# EAGLE design LMP9100_breakout_V2 (EAGLE 7.7.0)
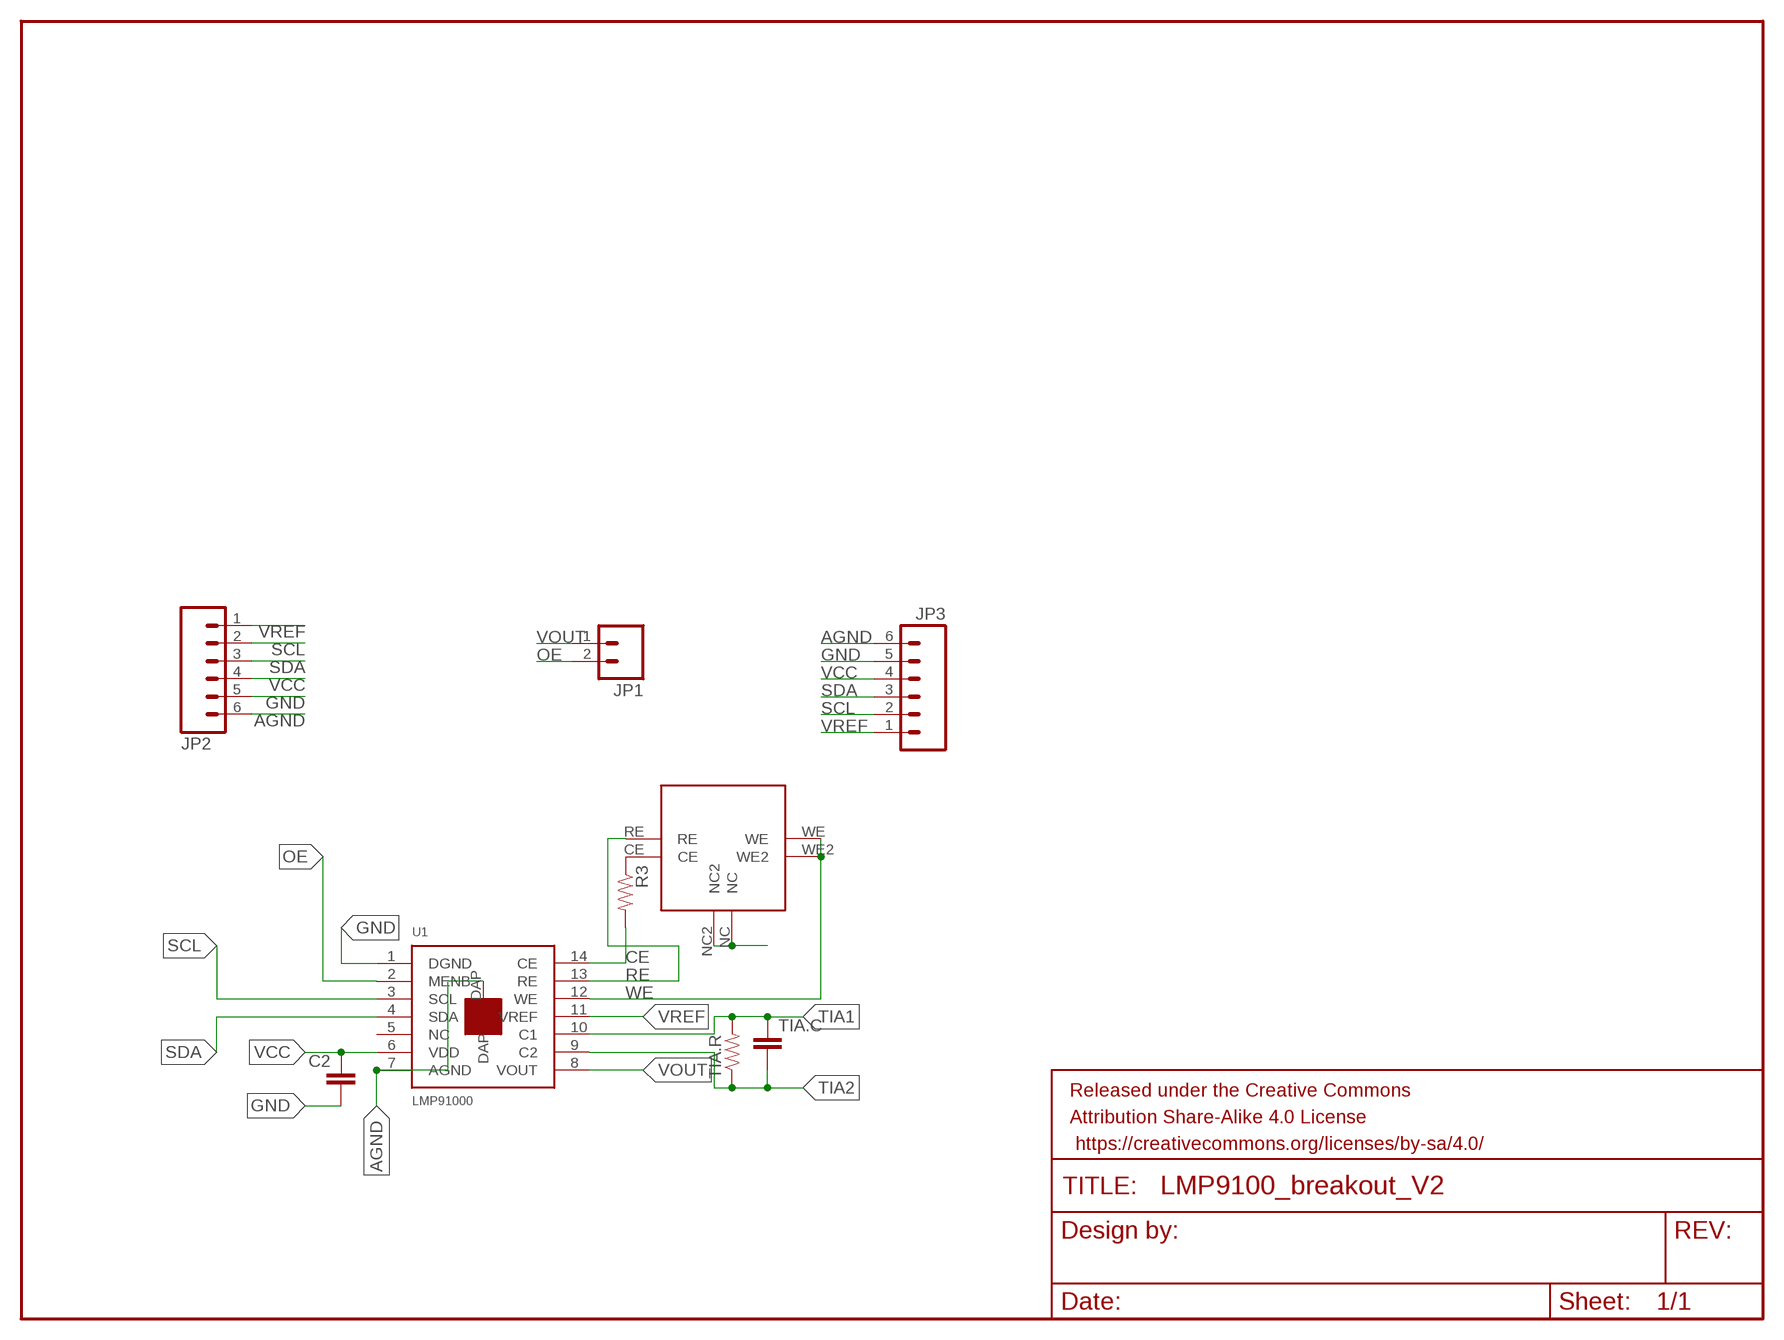
[diagram p0: schematic, sheet 1]

## Parts
C2  CAP0603-CAP  [0603-CAP]
FRAME1  FRAME-LETTER  [CREATIVE_COMMONS]
JP1  M02PTH  [1X02]
JP2  M06SILK_FEMALE_PTH  [1X06]
JP3  M06SILK_FEMALE_PTH  [1X06]
R3  RESISTOR0603-RES  [0603-RES]
TIA.C  CAP0603-CAP  [0603-CAP]
TIA.R  RESISTOR0603-RES  [0603-RES]
U1  LMP91000  [LMP91000]
U$1  SPEC-SENSOR  [SPEC-SENSOR]

## Nets
AGND: JP2.6 JP3.6 U1.7(AGND) U1.DAP
CE: R3.2 U1.14(CE)
GND: C2.2 JP2.5 JP3.5 U1.1(DGND) U$1.NC U$1.NC2
N$1: R3.1 U$1.CE
OE: JP1.2 U1.2(MENB)
RE: U1.13(RE) U$1.RE
SCL: JP2.2 JP3.2 U1.3(SCL)
SDA: JP2.3 JP3.3 U1.4(SDA)
TIA1: TIA.C.1 TIA.R.2 U1.10(C1)
TIA2: TIA.C.2 TIA.R.1 U1.9(C2)
VCC: C2.1 JP2.4 JP3.4 U1.6(VDD)
VOUT: JP1.1 U1.8(VOUT)
VREF: JP2.1 JP3.1 U1.11(VREF)
WE: U1.12(WE) U$1.WE U$1.WE2
Unconnected: U1.5(NC)

## Library data of the parts
C2 TIA.C = SparkFun-Passives:CAP: Capacitor Standard 0603 ceramic capacitor, and 0.1" leaded capacitor.
FRAME1 = SparkFun-Aesthetics:FRAME-LETTER: Schematic Frame Standard 8.5x11 US Letter frame
JP1 = SparkFun-Connectors:M02: Standard 2-pin 0.1" header. Use with - straight break away headers ( PRT-00116) - right angle break away headers (PRT-00553) - swiss pins (PRT-00743) - machine pins (PRT-00117) - female headers (PRT-00115) Molex polarized connector foot print use with: PRT-08233 with associated crimp pins and housings. 2.54_SCREWTERM for use with PRT-10571. 3.5mm Screw Terminal footprints for PRT-08084 5mm Screw Terminal footprints for use with PRT-08432
JP2 JP3 = SparkFun-Connectors:M06: Header 6 Standard 6-pin 0.1" header. Use with straight break away headers (SKU : PRT-00116), right angle break away headers (PRT-00553), swiss pins (PRT-00743), machine pins (PRT-00117), and female headers (PRT-00115). Molex polarized connector foot print use with SKU : PRT-08094 with associated crimp pins and housings. NOTES ON THE VARIANTS LOCK and LOCK_LONGPADS... This footprint was designed to help hold the alignment of a through-hole component (i.e. 6-pin header) while soldering it into place. You may notice that each hole has been shifted either up or down by 0.005 of an inch from it's more standard position (which is a perfectly straight line). This slight alteration caused the pins (the squares in the middle) to touch the edges of the holes. Because they are alternating, it causes a "brace" to hold the component in place. 0.005 has proven to be the perfect amount of "off-center" position when using our standard breakaway headers. Although looks a little odd when you look at the bare footprint, once you have a header in there, the alteration is very hard to notice. Also,if you push a header all the way into place, it is covered up entirely on the bottom side. This idea of altering the position of holes to aid alignment will be further integrated into the Sparkfun Library for other footprints. It can help hold any component with 3 or more connection pins.; PROD_ID: CONN-08437
R3 TIA.R = SparkFun-Passives:RESISTOR: Resistor Basic schematic elements and footprints for 0603, 1206, and PTH resistors.
U1 = lmp91000:LMP91000
U$1 = lmp91000:SPEC-SENSOR

## Board
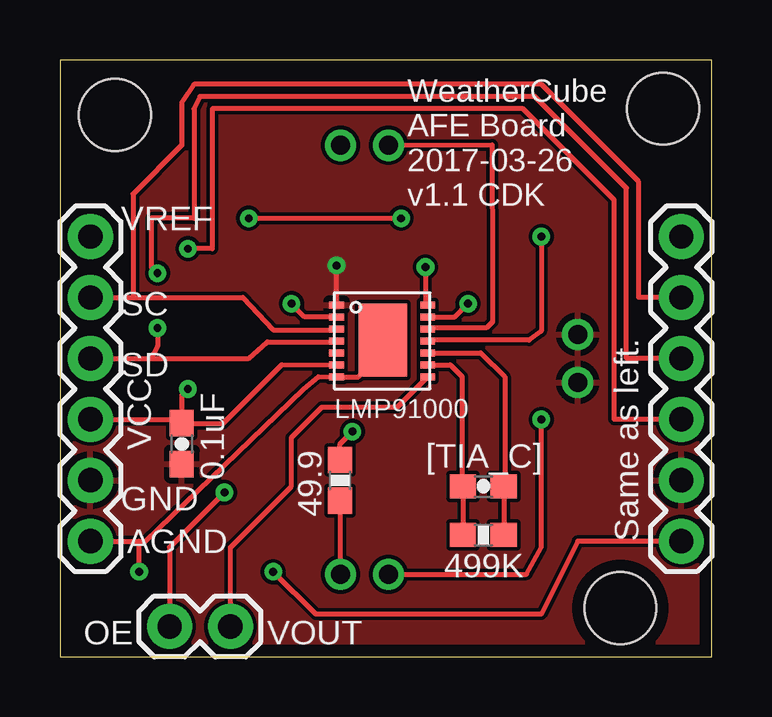
[diagram p1: board, top side]
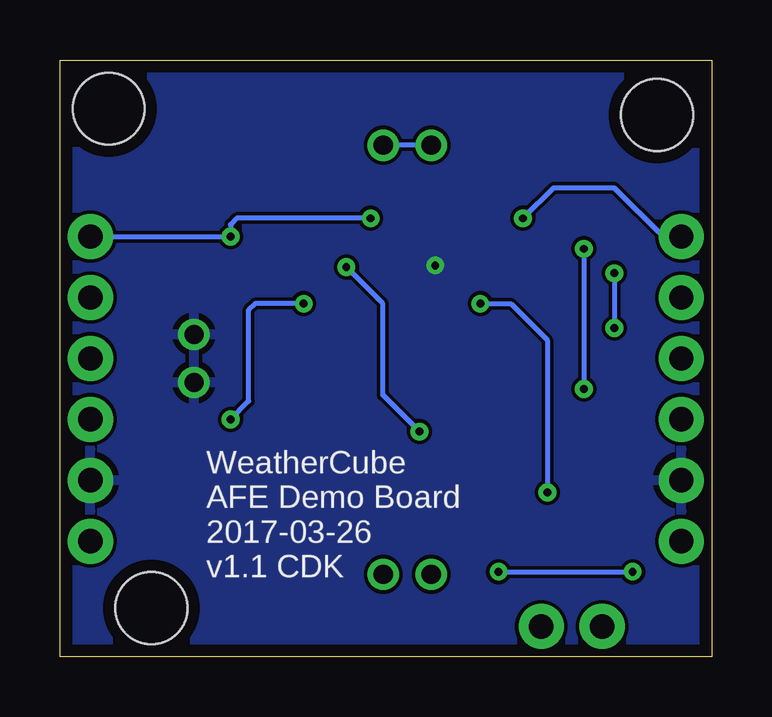
[diagram p2: board, bottom side, seen from below]

Size 27.18 x 24.89 mm. Coordinates in mm from the lower left corner, seen from the top.
Outline: 27.18,24.89 0,24.89 0,0 27.18,0 27.18,24.89
Copper layers (1*16): Top 0.035mm / dielectric 1.5mm / Bottom 0.035mm
Design rules "default *": minimum track width 10mil, minimum drill 24mil, track to track 6mil, track to pad 8mil, pad to pad 8mil, via to via 8mil, smd to smd 8mil, copper to edge 20mil, drill to drill 8mil, minimum pad ring 10mil, minimum via ring 8mil, stop-mask expansion 4mil, vias tented up to drill 13mil, thermal gap 10mil
Holes 3 mm at 2.29,22.61 25.15,22.86 23.37,2.03

### Footprints (pad centres in the part's own frame; a part is rotated, then mirrored left to right if it is on the bottom)
0603-CAP = smd 1.1 x 1: 1 -0.85,0; 2 0.85,0
1X02 = drill 1.016 pad 1.88: 1 0,0; 2 2.54,0
1X06 = drill 1.016 pad 1.88: 1 0,0; 2 2.54,0; 3 5.08,0; 4 7.62,0; 5 10.16,0; 6 12.7,0
0603-RES = smd 1.1 x 1: 1 -0.85,0; 2 0.85,0
LMP91000 = smd 0.61 x 0.305: 1 0.1,3.5; 2 0.1,3; 3 0.1,2.5; 4 0.1,2; 5 0.1,1.5; 6 0.1,1; 7 0.1,0.5; 8 3.9,0.5; 9 3.9,1; 10 3.9,1.5; 11 3.9,2; 12 3.9,2.5; 13 3.9,3; 14 3.9,3.5 | smd 2.032 x 3.048: DAP 2.032,2.032
SPEC-SENSOR = drill 0.8: CE 17.89,-1; NC 7.89,8.89; NC2 9.89,8.89; RE 17.89,1; WE 0,-1; WE2 0,1

### Placement (x,y rotation side)
C2  5.08,8.89 270 top
FRAME1  19.05,-16.51 0 top  (outside the outline)
JP1  7.11,1.27 180 top
JP2  1.27,17.53 270 top
JP3  25.91,17.53 270 top
R3  11.68,7.37 90 top
TIA.C  17.65,7.11 180 top
TIA.R  17.65,5.08 0 top
U1  11.43,11.18 0 top
U$1  12.7,21.34 270 top

### Tracks (layer width: path | path; a pad name or v marks a point on that pad's centre or on a via)
AGND  (via drill 0.33)
  Top 0.203: JP2.6 3.3,4.83 | 3.3,4.83 3.56,4.83 10.16,11.18 10.78,11.68 U1.7 12.44,11.68 12.7,11.94 12.7,12.45 U1.DAP | JP3.6 21.59,4.83 20.07,1.78 10.67,1.78 v8.89,3.56 | v3.3,3.56 3.3,4.83
  Bottom 0.203: v8.89,3.56 v3.3,3.56
CE  (via drill 0.33)
  Top 0.203: R3.2 11.68,8.89 v12.19,9.4 | v15.24,16.26 15.24,14.77 U1.14
  Bottom 0.203: v12.19,9.4 13.72,10.92 13.72,14.73 v15.24,16.26
GND  (via drill 0.33)
  Top 0.203: U1.1 v11.53,16.33
  pour Bottom: -5.33,-2.52 -5.33,28.32 28.07,28.3 28.07,-2.54
  pour Top: -4.57,31.24 28.96,30.48 28.96,-5.08 -4.57,-4.32
N$1
  Top 0.203: R3.1 11.68,3.46 U$1.CE
OE  (via drill 0.33)
  Top 0.203: U1.2 10.21,14.18 v9.65,14.73 | v6.86,6.86 4.57,4.57 JP1.2
  Bottom 0.203: v9.65,14.73 8.38,14.73 6.86,13.21 v6.86,6.86
RE  (via drill 0.33)
  Top 0.203: U1.13 16.46,14.18 v17.02,14.73 | U$1.RE 19.45,3.45 20.07,4.57 v20.07,9.91
  Bottom 0.203: v17.02,14.73 19.05,14.73 19.3,14.48 19.3,10.67 v20.07,9.91
SCL
  Top 0.203: JP2.2 3.05,14.99 | 3.05,14.99 7.62,14.99 8.89,13.64 11.44,13.64 U1.3 | JP3.2 24.13,14.99 24.13,19.81 20.07,23.88 5.59,23.88 5.08,23.11 5.08,21.34 3.05,19.3 3.05,14.99
SDA  (via drill 0.33)
  Top 0.203: JP2.3 3.81,12.45 | 3.81,12.45 7.87,12.45 8.64,13.13 11.44,13.13 U1.4 | JP3.3 23.62,12.45 23.62,19.56 19.81,23.37 5.84,23.37 5.59,22.86 5.59,18.29 3.81,18.29 3.81,16.26 v4.06,16 | v4.06,13.72 4.06,12.95 3.81,12.45
  Bottom 0.203: v4.06,16 v4.06,13.72
TIA1
  Top 0.203: TIA.R.2 TIA.C.1 18.54,7.15 18.54,11.68 17.55,12.68 U1.10
TIA2
  Top 0.203: TIA.R.1 TIA.C.2 16.76,7.15 16.76,11.68 16.27,12.18 U1.9
VCC  (via drill 0.33)
  Top 0.203: C2.1 6.81,9.74 9.26,12.19 U1.6 | JP3.4 23.11,9.91 23.11,19.05 19.3,22.86 6.35,22.86 6.35,17.02 v5.33,17.02 | v5.33,11.18 5.08,10.92 C2.1 | JP2.4 4.91,9.91 C2.1
  Bottom 0.203: v5.33,17.02 v5.33,11.18
VOUT
  Top 0.203: JP1.1 7.11,4.57 9.65,7.11 9.65,9.14 10.92,10.41 14.07,10.41 U1.8
VREF  (via drill 0.33)
  Top 0.203: v20.07,17.53 20.07,13.59 19.56,13.21 15.36,13.21 U1.11 | v7.87,18.29 v14.22,18.29
  Bottom 0.203: JP3.1 v20.07,17.53 20.07,18.03 19.81,18.29 v14.22,18.29 | JP2.1 2.03,17.53 4.06,19.56 6.6,19.56 v7.87,18.29
WE
  Top 0.203: U$1.WE2 18.02,21.35 18.03,16 18.03,13.97 17.78,13.72 15.37,13.72 U1.12
  Bottom 0.203: U$1.WE U$1.WE2

### Text on the board
tNames: WeatherCube / AFE Board / 2017-03-26 / v1.1 CDK | VREF | SC | SD | VCC | [TIA_C] | 0.1uF | GND | 49.9 | Same as left. | AGND | 499K | OE | VOUT
bNames: WeatherCube / AFE Demo Board / 2017-03-26 / v1.1 CDK